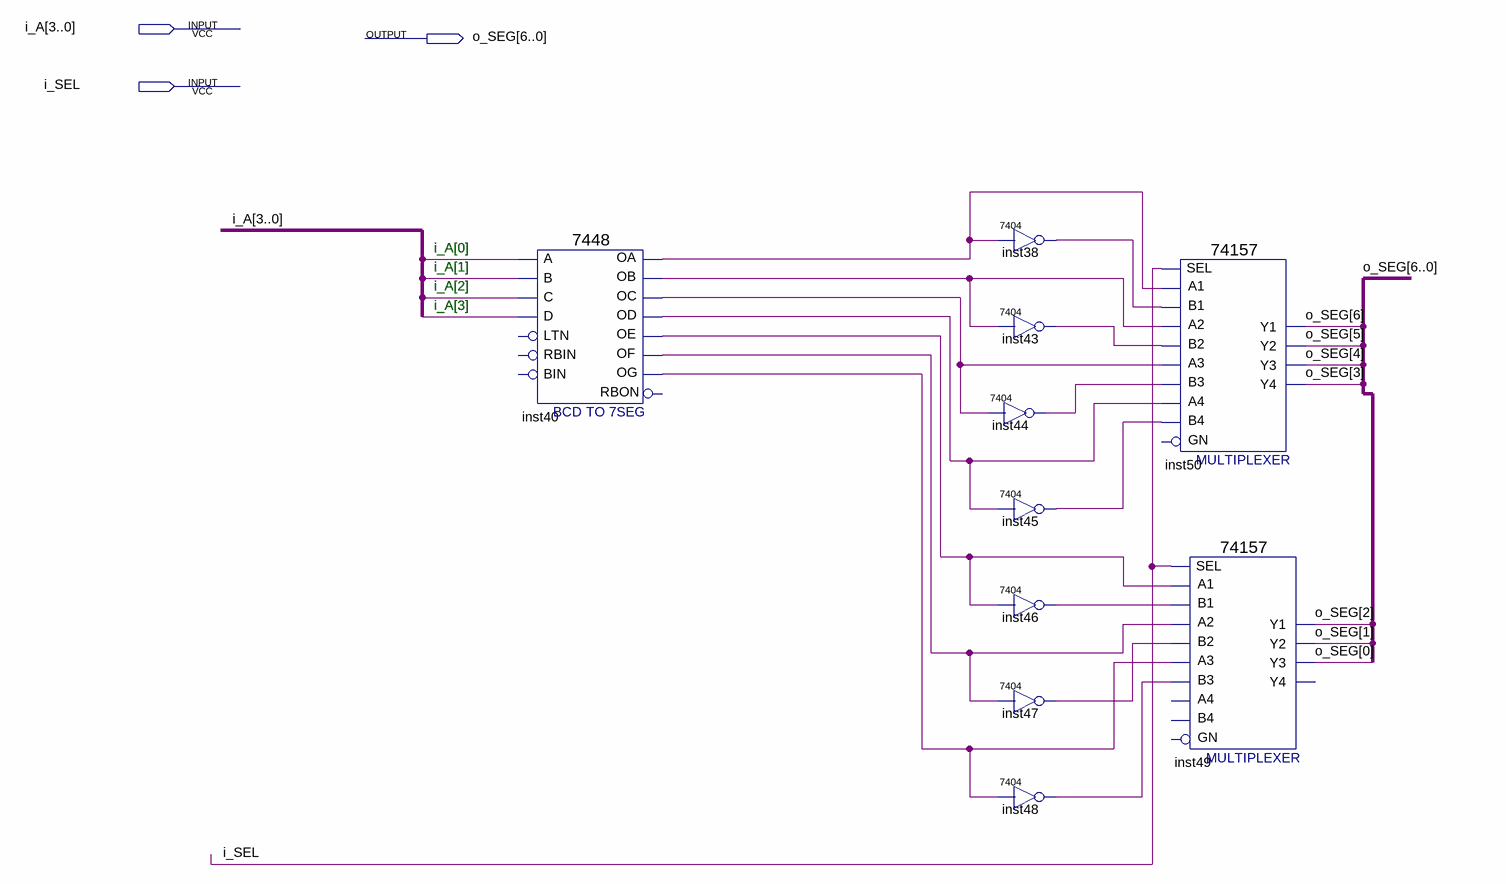
[diagram p0: schematic sheet]
// Quartus schematic ttl7448_minus.bdf as structural Verilog: 10 symbols, 3 pins
module ttl7448_minus (
  input  [3:0] i_A,
  input  i_SEL,
  output [6:0] o_SEG
);

  wire inst38_1, inst40_oa, inst40_ob, inst40_oc, inst40_od, inst40_oe, inst40_of, inst40_og, inst43_1,
       inst44_1, inst45_1, inst46_1, inst47_1, inst48_1;

  \7448  inst40 (
    .A(i_A[0]), .C(i_A[2]), .D(i_A[3]), .B(i_A[1]), .OC(inst40_oc), .OE(inst40_oe), .OD(inst40_od),
    .OF(inst40_of), .OG(inst40_og), .OB(inst40_ob), .OA(inst40_oa));  // open: RBIN, BIN, LTN, RBON
  \7404  inst38 (.\2 (inst40_oa), .\1 (inst38_1));
  \7404  inst43 (.\2 (inst40_ob), .\1 (inst43_1));
  \7404  inst44 (.\2 (inst40_oc), .\1 (inst44_1));
  \7404  inst45 (.\2 (inst40_od), .\1 (inst45_1));
  \7404  inst46 (.\2 (inst40_oe), .\1 (inst46_1));
  \7404  inst47 (.\2 (inst40_of), .\1 (inst47_1));
  \7404  inst48 (.\2 (inst40_og), .\1 (inst48_1));
  \74157  inst50 (
    .A1(inst40_oa), .B1(inst38_1), .SEL(i_SEL), .B2(inst43_1), .A3(inst40_oc), .B3(inst44_1), .A2(inst40_ob),
    .B4(inst45_1), .A4(inst40_od), .Y2(o_SEG[5]), .Y1(o_SEG[6]), .Y4(o_SEG[3]), .Y3(o_SEG[4]));  // open: GN
  \74157  inst49 (
    .A1(inst40_oe), .B1(inst46_1), .SEL(i_SEL), .B2(inst47_1), .A3(inst40_og), .B3(inst48_1), .A2(inst40_of),
    .Y2(o_SEG[1]), .Y1(o_SEG[2]), .Y3(o_SEG[0]));  // open: B4, GN, A4, Y4

  // Notes on the sheet:
  //   i_A[0]
  //   i_A[0]
  //   i_A[1]
  //   i_A[1]
  //   i_A[2]
  //   i_A[2]
  //   i_A[3]
  //   i_A[3]
endmodule
